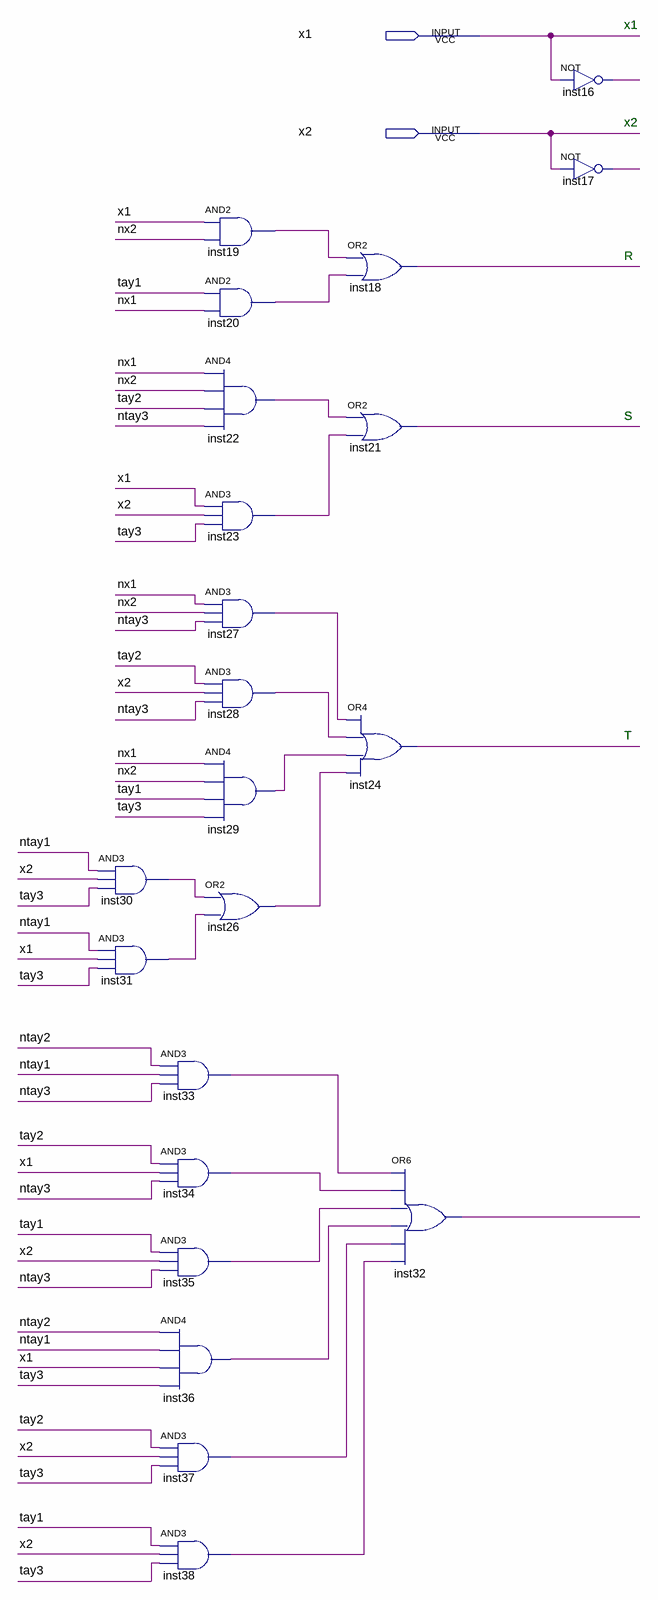
[diagram p0: schematic sheet]
// Quartus schematic vozb.bdf as structural Verilog: 22 symbols, 2 pins
module vozb (
  input  x1,
  input  x2
);

  wire inst16_out, inst17_out, inst19_out, inst20_out, inst22_out, inst23_out, inst26_out, inst27_out,
       inst28_out, inst29_out, inst30_out, inst31_out, inst32_out, inst33_out, inst34_out, inst35_out,
       inst36_out, inst37_out, inst38_out, ntay1, ntay2, ntay3, nx1, nx2, R, S, T, tay1, tay2, tay3;

  and inst30 (inst30_out, ntay1, x2, tay3);
  and inst31 (inst31_out, ntay1, x1, tay3);
  and inst19 (inst19_out, x1, nx2);
  and inst20 (inst20_out, tay1, nx1);
  and inst22 (inst22_out, nx1, nx2, tay2, ntay3);
  and inst23 (inst23_out, x1, x2, tay3);
  and inst27 (inst27_out, nx1, nx2, ntay3);
  and inst28 (inst28_out, tay2, x2, ntay3);
  and inst29 (inst29_out, nx1, nx2, tay1, tay3);
  or inst26 (inst26_out, inst30_out, inst31_out);
  and inst33 (inst33_out, ntay2, ntay1, ntay3);
  and inst34 (inst34_out, tay2, x1, ntay3);
  and inst35 (inst35_out, tay1, x2, ntay3);
  and inst36 (inst36_out, ntay2, ntay1, x1, tay3);
  and inst37 (inst37_out, tay2, x2, tay3);
  and inst38 (inst38_out, tay1, x2, tay3);
  or inst18 (R, inst19_out, inst20_out);
  or inst21 (S, inst22_out, inst23_out);
  or inst24 (T, inst27_out, inst28_out, inst29_out, inst26_out);
  or inst32 (inst32_out, inst33_out, inst34_out, inst35_out, inst36_out, inst37_out, inst38_out);
  not inst16 (inst16_out, x1);
  not inst17 (inst17_out, x2);

  // Notes on the sheet:
  //   x1
  //   x2
  //   R
  //   S
  //   T
endmodule
